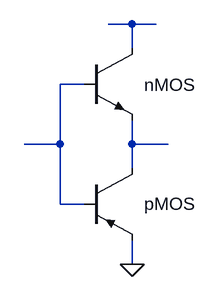
[diagram p0: schematic CMOSinverter.asc]
CMOSinverter.asc, the LTspice schematic file:
Version 4
SHEET 1 880 680
WIRE 192 0 160 0
WIRE 224 0 192 0
WIRE 192 32 192 0
WIRE 128 80 96 80
WIRE 96 160 96 80
WIRE 96 160 48 160
WIRE 192 160 192 128
WIRE 240 160 192 160
WIRE 192 192 192 160
WIRE 96 240 96 160
WIRE 128 240 96 240
WIRE 192 320 192 288
FLAG 192 320 0
SYMBOL npn 128 32 R0
WINDOW 0 80 49 Left 2
WINDOW 3 119 60 Left 2
SYMATTR InstName nMOS
SYMATTR Value ""
SYMBOL pnp 128 192 R0
WINDOW 0 80 48 Left 2
WINDOW 3 145 64 Left 2
SYMATTR InstName pMOS
SYMATTR Value ""

The netlist it stands for:
* CMOSinverter.asc
Q§nMOS N001 N002 N003 0
Q§pMOS N003 N002 0 0
.model NPN NPN
.model PNP PNP
.lib standard.bjt
.backanno
.end